# EAGLE design safssss (EAGLE 9.1.1)
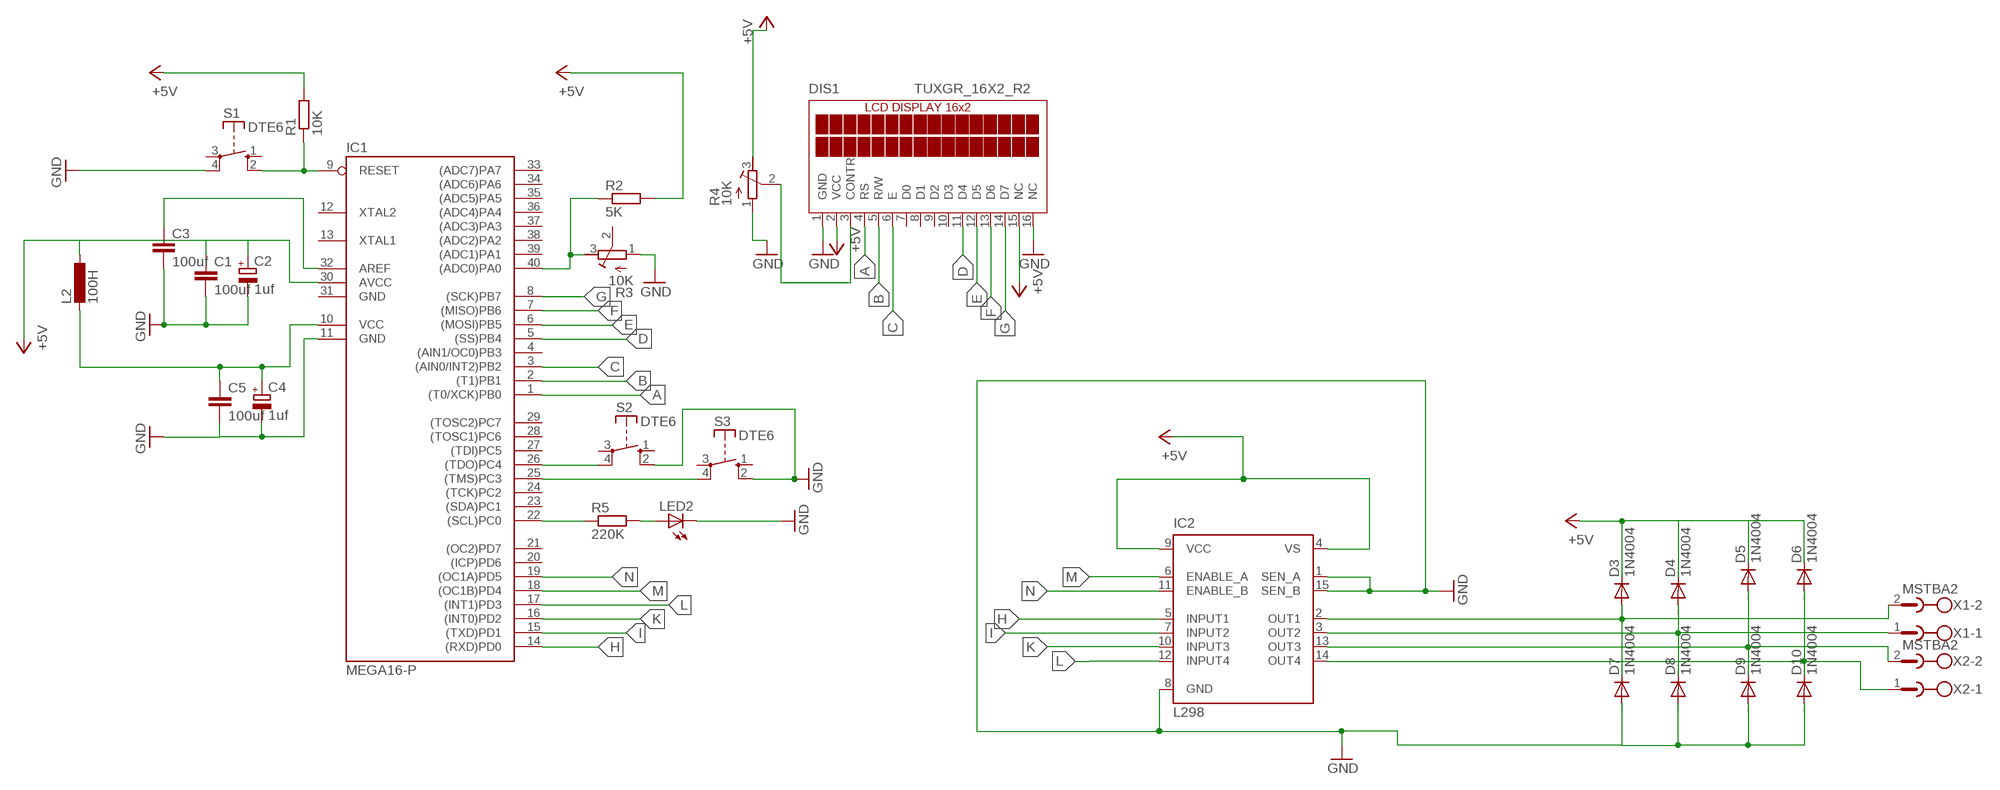
[diagram p0: schematic, sheet 1]

## Parts
C1  100uf  C-EU025-024X044  [C025-024X044]
C2  1uf  CPOL-EUB45181A  [B45181A]
C3  100uf  C-EU025-024X044  [C025-024X044]
C4  1uf  CPOL-EUB45181A  [B45181A]
C5  100uf  C-EU025-024X044  [C025-024X044]
D3  1N4004  [DO41-10]
D4  1N4004  [DO41-10]
D5  1N4004  [DO41-10]
D6  1N4004  [DO41-10]
D7  1N4004  [DO41-10]
D8  1N4004  [DO41-10]
D9  1N4004  [DO41-10]
D10  1N4004  [DO41-10]
DIS1  TUXGR_16X2_R2  [TUXGR_16X2_R2]
IC1  MEGA16-P  [DIL40]
IC2  L298  [MULTIWATT-15]
L2  100H  L-EU0204V  [0204V]
LED2  LED3MM  [LED3MM]
R1  10K  R-EU_0204/2V  [0204V]
R2  5K  R-EU_0204/2V  [0204V]
R3  10K  R-TRIMM64Z  [RTRIM64Z]
R4  10K  R-TRIMM64Z  [RTRIM64Z]
R5  220K  R-EU_0204/2V  [0204V]
S1  DTE6  [DTE6]
S2  DTE6  [DTE6]
S3  DTE6  [DTE6]
X1  MSTBA2  [MSTBA2]
X2  MSTBA2  [MSTBA2]

## Nets
+5V: C1.1 C2.+ D3.C D4.C D5.C D6.C DIS1.2(VCC) DIS1.15(NC) IC1.30(AVCC) IC2.4(VS) IC2.9(VCC) L2.1 R1.2 R2.2 R4.3(E)
A: DIS1.4(RS) IC1.1((T0/XCK)PB0)
B: DIS1.5(R/W) IC1.2((T1)PB1)
C: DIS1.6(E) IC1.3((AIN0/INT2)PB2)
D: DIS1.11(D4) IC1.5((SS)PB4)
E: DIS1.12(D5) IC1.6((MOSI)PB5)
F: DIS1.13(D6) IC1.7((MISO)PB6)
G: DIS1.14(D7) IC1.8((SCK)PB7)
GND: C1.2 C2.- C3.2 C4.- C5.2 D7.A D8.A D9.A D10.A DIS1.1(GND) DIS1.16(NC) IC1.11(GND) IC2.1(SEN_A) IC2.8(GND) IC2.15(SEN_B) LED2.K(C) R3.1(A) R4.1(A) S1.4(P) S2.2(S) S3.2(S)
H: IC1.14((RXD)PD0) IC2.5(INPUT1)
I: IC1.15((TXD)PD1) IC2.7(INPUT2)
K: IC1.16((INT0)PD2) IC2.10(INPUT3)
L: IC1.17((INT1)PD3) IC2.12(INPUT4)
M: IC1.18((OC1B)PD4) IC2.6(ENABLE_A)
N: IC1.19((OC1A)PD5) IC2.11(ENABLE_B)
N$1: IC1.9(RESET) R1.1 S1.2(S)
N$2: IC1.40((ADC0)PA0) R2.1 R3.3(E)
N$3: C3.1 IC1.32(AREF)
N$4: C4.+ C5.1 IC1.10(VCC) L2.2
N$5: DIS1.3(CONTR) R4.2(S)
N$6: IC1.22((SCL)PC0) R5.1
N$7: LED2.A R5.2
N$8: D3.A D7.C IC2.2(OUT1) X1.2
N$9: D4.A D8.C IC2.3(OUT2) X1.1
N$10: D5.A D9.C IC2.13(OUT3) X2.2
N$11: D6.A D10.C IC2.14(OUT4) X2.1
N$12: IC1.26((TDO)PC4) S2.4(P)
N$13: IC1.25((TMS)PC3) S3.4(P)
Unconnected: DIS1.7(D0) DIS1.8(D1) DIS1.9(D2) DIS1.10(D3) IC1.4((AIN1/OC0)PB3) IC1.12(XTAL2) IC1.13(XTAL1) IC1.20((ICP)PD6) IC1.21((OC2)PD7) IC1.23((SDA)PC1) IC1.24((TCK)PC2) IC1.27((TDI)PC5) IC1.28((TOSC1)PC6) IC1.29((TOSC2)PC7) IC1.33((ADC7)PA7) IC1.34((ADC6)PA6) IC1.35((ADC5)PA5) IC1.36((ADC4)PA4) IC1.37((ADC3)PA3) IC1.38((ADC2)PA2) IC1.39((ADC1)PA1) R3.2(S) S1.1(S) S1.3(P) S2.1(S) S2.3(P) S3.1(S) S3.3(P)

## Power pins joined to a net without a drawn wire
GND: IC1.31(GND)

## Library data of the parts
C1 C3 C5 = rcl:C-EU: CAPACITOR, European symbol; SPICEPREFIX: C
C2 C4 = rcl:CPOL-EU: POLARIZED CAPACITOR, European symbol; SPICEPREFIX: C
D3 D5-D10 = diode:1N4004: DIODE general purpose rectifier, 1 A; SPICEPREFIX: D
D4 = diode:1N4004: DIODE general purpose rectifier, 1 A
DIS1 = display-lcd:TUXGR_16X2_R2: Tuxgraphics LCD display 16x2 characters reflective, without background light Source: tuxgr_12x2_r2.pdf; OC_FARNELL: unknown; OC_NEWARK: unknown
IC1 = atmel:MEGA16-P: MICROCONTROLLER 16 Kbytes FLASH 1 kbytes SRAM 512 bytes EEPROM USART 8-channel 10 bit ADC Source: avr.lbr; MPN: ATMEGA16-16PU; OC_FARNELL: 9171142; OC_NEWARK: 01M6885
IC2 = st-microelectronics:L298: DUAL FULL-BRIDGE DRIVER; MPN: L298N; OC_FARNELL: 1589425; OC_NEWARK: 32M1527
L2 = rcl:L-EU: INDUCTOR, European symbol; SPICEPREFIX: L
LED2 = led:LED: LED OSRAM: - CHIPLED LG R971, LG N971, LY N971, LG Q971, LY Q971, LO R971, LY R971 LH N974, LH R974 LS Q976, LO Q976, LY Q976 LO Q996 - Hyper CHIPLED LW Q18S LB Q993, LB Q99A, LB R99A - SideLED LS A670, LO A670, LY A670, LG A670, LP A670 LB A673, LV A673, LT A673, LW A673 LH A674 LY A675 LS A676, LA A676, LO A676, LY A676, LW A676 LS A679, LY A679, LG A679 - Hyper Micro SIDELED® LS Y876, LA Y876, LO Y876, LY Y876 LT Y87S - SmartLED LW L88C, LW L88S LB L89C, LB L89S, LG L890 LS L89K, LO L89K, LY L89K LS L896, LA L896, LO L896, LY L896 - TOPLED LS T670, LO T670, LY T670, LG T670, LP T670 LSG T670, LSP T670, LSY T670, LOP T670, LYG T670 LG T671, LOG T671, LSG T671 LB T673, LV T673, LT T673, LW T673 LH T674 LS T676, LA T676, LO T676, LY T676, LB T676, LH T676, LSB T676, LW T676 LB T67C, LV T67C, LT T67C, LS T67K, LO T67K, LY T67K, LW E67C LS E67B, LA E67B, LO E67B, LY E67B, LB E67C, LV E67C, LT E67C LW T67C LS T679, LY T679, LG T679 LS T770, LO T770, LY T770, LG T770, LP T770 LB T773, LV T773, LT T773, LW T773 LH T774 LS E675, LA E675, LY E675, LS T675 LS T776, LA T776, LO T776, LY T776, LB T776 LHGB T686 LT T68C, LB T68C - Hyper Mini TOPLED® LB M676 - Mini TOPLED Santana® LG M470 LS M47K, LO M47K, LY M47K Source: http://www.osram.convergy.de LUXEON: - LUMILED® LXK2-PW12-R00, LXK2-PW12-S00, LXK2-PW14-U00, LXK2-PW14-V00 LXK2-PM12-R00, LXK2-PM12-S00, LXK2-PM14-U00 LXK2-PE12-Q00, LXK2-PE12-R00, LXK2-PE12-S00, LXK2-PE14-T00, LXK2-PE14-U00 LXK2-PB12-K00, LXK2-PB12-L00, LXK2-PB12-M00, LXK2-PB14-N00, LXK2-PB14-P00, LXK2-PB14-Q00 LXK2-PR12-L00, LXK2-PR12-M00, LXK2-PR14-Q00, LXK2-PR14-R00 LXK2-PD12-Q00, LXK2-PD12-R00, LXK2-PD12-S00 LXK2-PH12-R00, LXK2-PH12-S00 LXK2-PL12-P00, LXK2-PL12-Q00, LXK2-PL12-R00 Source: www.luxeon.com KINGBRIGHT: KA-3528ASYC Source: www.kingbright.com
R1 R2 R5 = resistor:R-EU_: RESISTOR, European symbol
R3 R4 = resistor:R-TRIMM: Trimm resistor
S1-S3 = switch-misc:DT: ITT SWITCH
X1 X2 = con-phoenix-508:MSTBA2: PHOENIX; MF: FARNELL; MPN: 1757242; OC_FARNELL: 3705171; OC_NEWARK: 71C4161

## Board
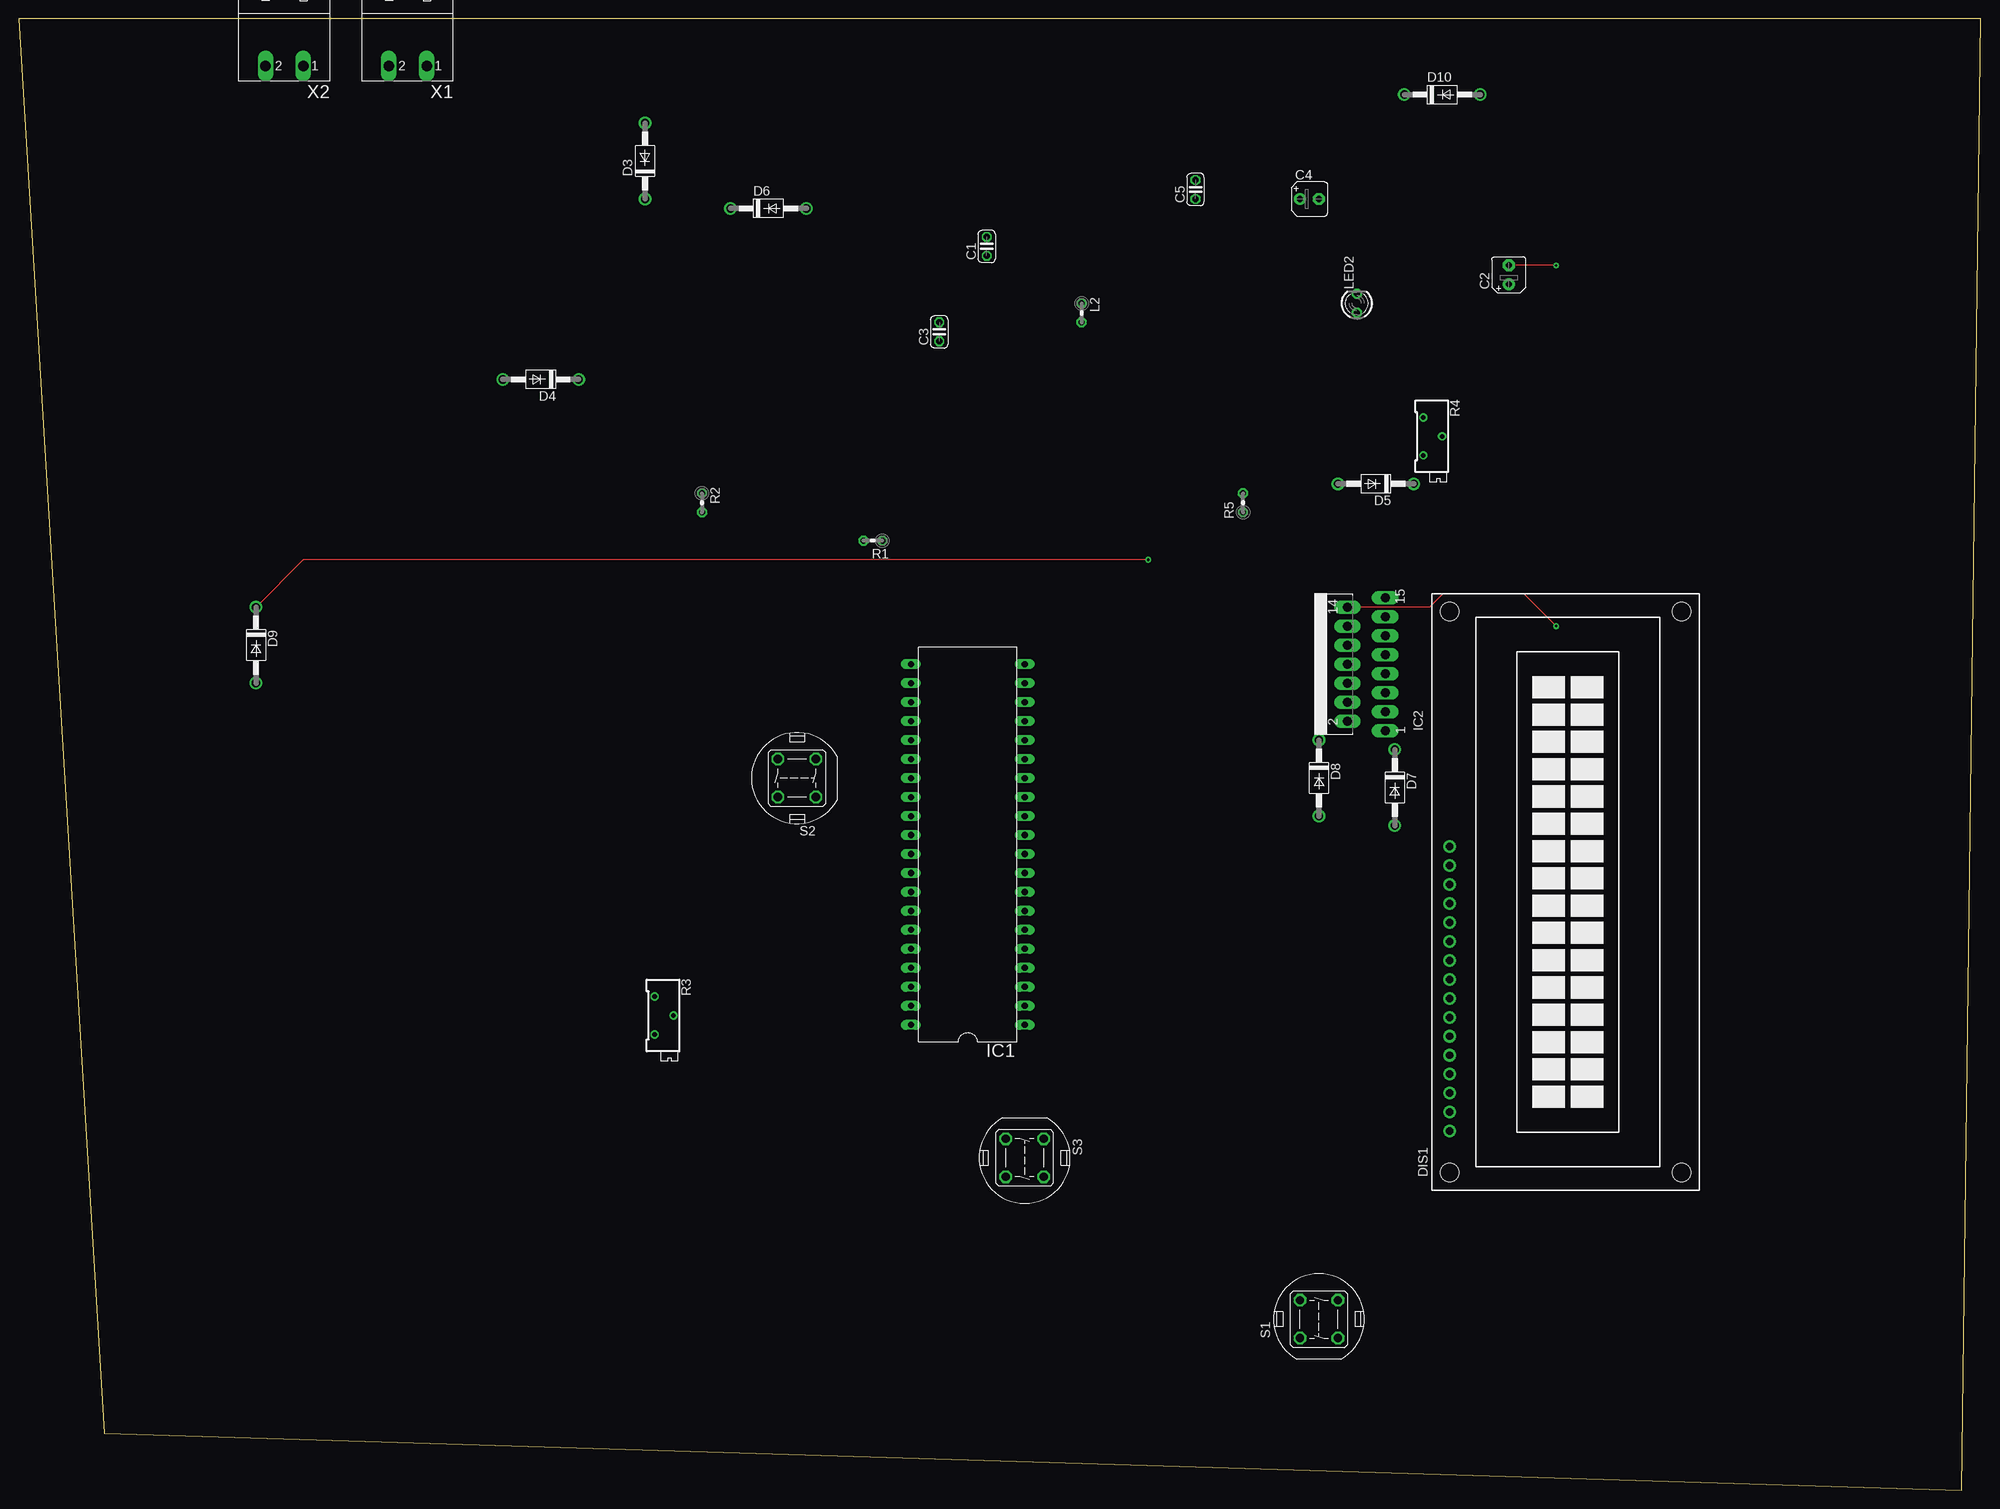
[diagram p1: board, top side]
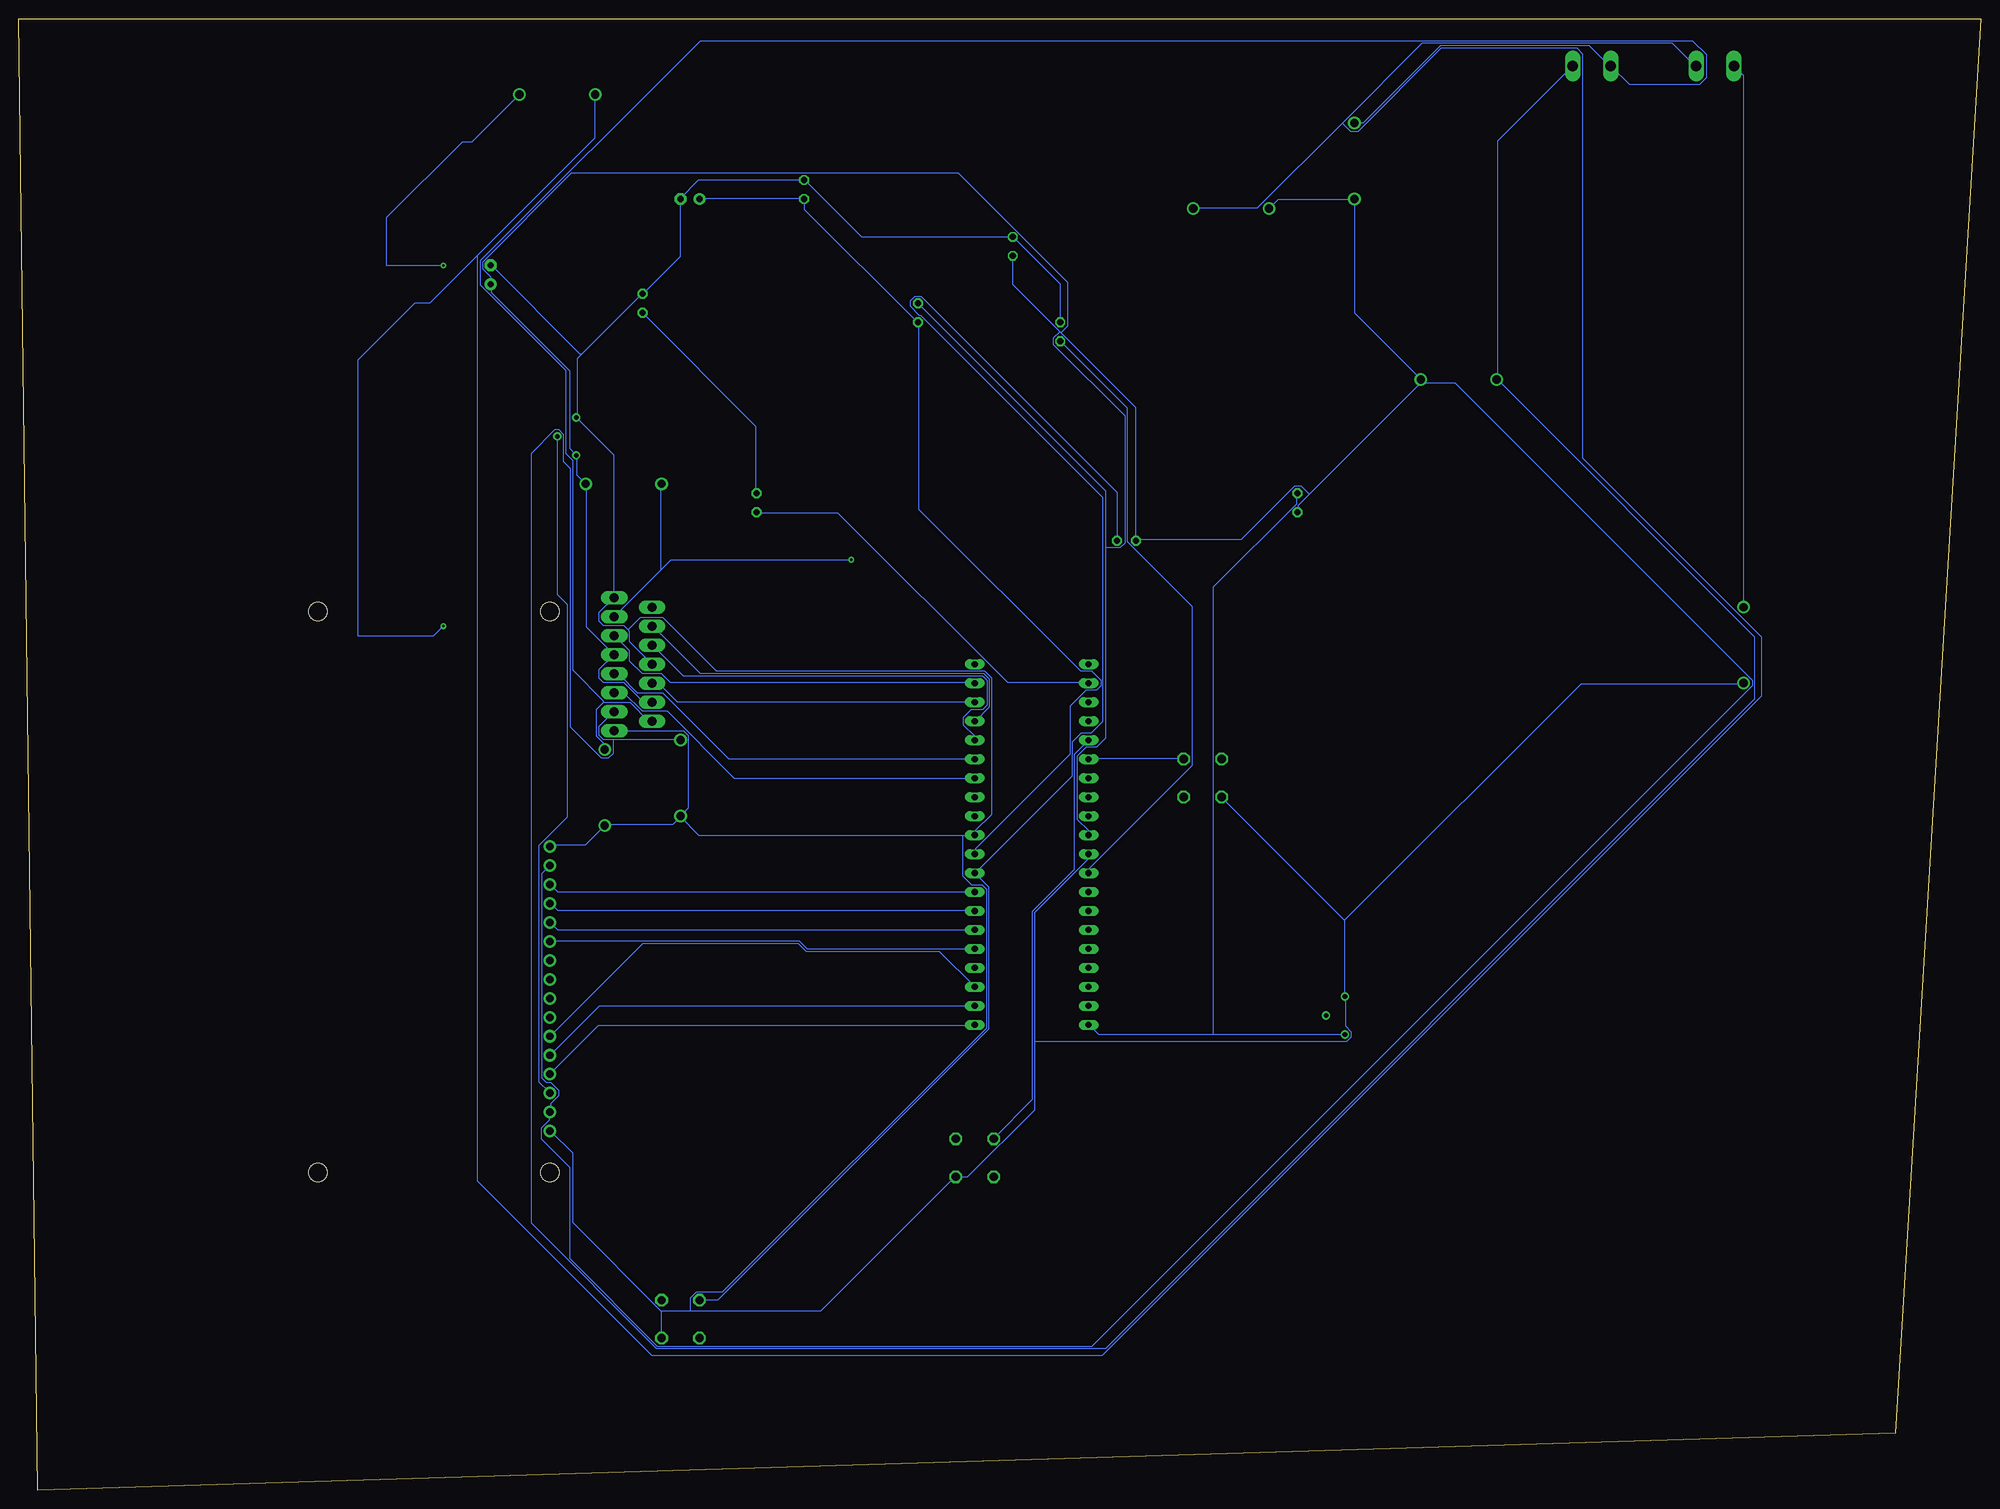
[diagram p2: board, bottom side, seen from below]

Size 262.56 x 196.84 mm. Coordinates in mm from the lower left corner, seen from the top.
Outline: 11.43,7.62 260.02,0 262.56,196.84 0,196.84 11.43,7.62
Copper layers (1*16): Top 0.035mm / dielectric 1.5mm / Bottom 0.035mm
Design rules "default": minimum track width 6mil, minimum drill 0.35mm, track to track 6mil, track to pad 6mil, pad to pad 6mil, via to via 6mil, smd to smd 6mil, copper to edge 40mil, drill to drill 6mil, minimum pad ring 10mil, minimum via ring 8mil, stop-mask expansion 4mil, vias tented up to drill 0mil, thermal gap 10mil

### Footprints (pad centres in the part's own frame; a part is rotated, then mirrored left to right if it is on the bottom)
C025-024X044 = drill 0.813 octagon: 1 -1.27,0; 2 1.27,0
B45181A = drill 0.813 pad 1.6: + -1.27,0 | drill 0.813 pad 1.6 octagon: - 1.27,0
DO41-10 = drill 1.118: A 5.08,0; C -5.08,0
TUXGR_16X2_R2 = drill 1 pad 1.676: 1 -32,15.5; 2 -29.46,15.5; 3 -26.92,15.5; 4 -24.38,15.5; 5 -21.84,15.5; 6 -19.3,15.5; 7 -16.76,15.5; 8 -14.22,15.5; 9 -11.68,15.5; 10 -9.14,15.5; 11 -6.6,15.5; 12 -4.06,15.5; 13 -1.52,15.5; 14 1.02,15.5; 15 3.56,15.5; 16 6.1,15.5 | hole 2.5: -37.5,-15.5; 37.5,-15.5; -37.5,15.5; 37.5,15.5
DIL40 = drill 0.813 long: 1 -24.13,-7.62; 2 -21.59,-7.62; 3 -19.05,-7.62; 4 -16.51,-7.62; 5 -13.97,-7.62; 6 -11.43,-7.62; 7 -8.89,-7.62; 8 -6.35,-7.62; 9 -3.81,-7.62; 10 -1.27,-7.62; 11 1.27,-7.62; 12 3.81,-7.62; 13 6.35,-7.62; 14 8.89,-7.62; 15 11.43,-7.62; 16 13.97,-7.62; 17 16.51,-7.62; 18 19.05,-7.62; 19 21.59,-7.62; 20 24.13,-7.62; 21 24.13,7.62; 22 21.59,7.62; 23 19.05,7.62; 24 16.51,7.62; 25 13.97,7.62; 26 11.43,7.62; 27 8.89,7.62; 28 6.35,7.62; 29 3.81,7.62; 30 1.27,7.62; 31 -1.27,7.62; 32 -3.81,7.62; 33 -6.35,7.62; 34 -8.89,7.62; 35 -11.43,7.62; 36 -13.97,7.62; 37 -16.51,7.62; 38 -19.05,7.62; 39 -21.59,7.62; 40 -24.13,7.62
MULTIWATT-15 = drill 1.2 long: 1 -8.89,-7.62; 2 -7.62,-2.54; 3 -6.35,-7.62; 4 -5.08,-2.54; 5 -3.81,-7.62; 6 -2.54,-2.54; 7 -1.27,-7.62; 8 0,-2.54; 9 1.27,-7.62; 10 2.54,-2.54; 11 3.81,-7.62; 12 5.08,-2.54; 13 6.35,-7.62; 14 7.62,-2.54; 15 8.89,-7.62
0204V = drill 0.813 octagon: 1 -1.27,0; 2 1.27,0
LED3MM = drill 0.813 octagon: A -1.27,0; K 1.27,0
RTRIM64Z = drill 0.61: 1 0,-2.54; 2 -2.54,0; 3 0,2.54
DTE6 = drill 1.118 octagon: 1 -2.54,2.54; 2 2.54,2.54; 3 2.54,-2.54; 4 -2.54,-2.54
MSTBA2 = drill 1.397 long: 1 -2.54,5.08; 2 2.54,5.08

### Placement (x,y rotation side)
C1  129.54,166.37 90 top
C2  199.39,162.56 90 top
C3  123.19,154.94 90 top
C4  172.72,172.72 0 top
C5  157.48,173.99 90 top
D3  83.82,177.8 90 top
D4  69.85,148.59 180 top
D5  181.61,134.62 180 top
D6  100.33,171.45 0 top
D7  184.15,93.98 270 top
D8  173.99,95.25 270 top
D9  31.75,113.03 270 top
D10  190.5,186.69 0 top
DIS1  207.01,80.01 90 top
IC1  127,86.36 90 top
IC2  175.26,110.49 90 top
L2  142.24,157.48 270 top
LED2  179.07,158.75 90 top
R1  114.3,127 180 top
R2  91.44,132.08 270 top
R3  85.09,63.5 180 top
R4  187.96,140.97 180 top
R5  163.83,132.08 90 top
S1  173.99,22.86 90 top
S2  104.14,95.25 180 top
S3  134.62,44.45 270 top
X1  52.07,195.58 180 top
X2  35.56,195.58 180 top

### Tracks (layer width: path | path; a pad name or v marks a point on that pad's centre or on a via)
+5V
  Bottom 0.152: 117.15,126.03 117.15,133.66 L2.1 | 117.15,126.03 117.15,100.58 118.36,99.37 119.74,99.37 120.96,98.15 120.96,89.76 119.43,88.24 119.43,87.63 IC1.30 | IC2.4 177.8,105.46 179.02,105.46 181.61,108.05 184.35,108.05 184.96,108.66 184.96,109.73 182.98,111.71 IC2.9 186.64,115.52 186.64,134.57 D5.C 187.86,135.79 187.86,138.38 R4.3 188.01,138.53 188.77,139.29 188.77,149.66 199.29,160.17 199.29,161.24 C2.+ 199.44,161.39 199.44,162.31 200.51,163.37 200.51,164.29 188.62,176.17 136.8,176.17 122.17,161.54 122.17,155.75 123.09,154.84 | DIS1.15 191.52,83.52 192.58,82.45 192.58,55.17 191.97,54.56 191.36,54.56 190.3,53.49 190.3,52.73 191.36,51.66 191.36,50.6 DIS1.2 191.52,50.44 191.52,49.53 192.58,48.46 192.58,46.94 188.77,43.13 188.77,30.94 177.04,19.2 118.97,19.2 30.58,107.59 30.58,108.36 70.36,148.13 74.93,148.13 | D6.C 95.2,171.45 93.98,172.67 83.92,172.67 D3.C 83.77,172.67 83.77,157.43 D4.C 74.93,148.13 | 74.93,148.13 89.87,133.2 | 89.87,133.2 91.39,131.67 91.39,130.91 R2.2 | 113.03,127.1 99.01,127.1 91.85,134.26 90.93,134.26 89.87,133.2 | 123.09,154.84 113.03,144.78 113.03,127.1 | 123.09,154.84 123.24,154.99 | 123.24,154.99 129.49,161.24 129.49,165.05 C1.1 | 113.03,127.1 R1.2 | 117.15,126.03 115.16,126.03 114.55,126.64 114.55,143.71 124.16,153.31 124.16,154.08 123.24,154.99
A
  Bottom 0.152: IC1.1 134.67,62.18 184.96,62.18 191.36,55.78 DIS1.4
B
  Bottom 0.152: IC1.2 184.81,64.77 191.36,58.22 DIS1.5
C
  Bottom 0.152: IC1.3 139.4,72.09 157.23,72.09 158.29,73.15 179.02,73.15 191.36,60.81 DIS1.6
D
  Bottom 0.152: IC1.5 157.07,72.39 158.14,73.46 191.36,73.46 DIS1.11
E
  Bottom 0.152: IC1.6 134.67,74.98 190.45,74.98 191.36,75.9 DIS1.12
F
  Bottom 0.152: IC1.7 134.67,77.57 190.45,77.57 191.36,78.49 DIS1.13
G
  Bottom 0.152: IC1.8 190.45,80.01 191.36,80.92 DIS1.14
GND  (via drill 0.35)
  Top 0.152: v205.74,163.83 C2.-
  Bottom 0.152: DIS1.16 191.36,86.26 186.79,86.26 D7.A 184.05,89 175.06,89 173.99,90.07 | 136.19,87.63 171.55,87.63 173.99,90.07 | 136.19,87.63 IC1.11 134.52,87.63 134.52,88.24 132.38,90.37 132.38,108.66 133.3,109.58 169.27,109.58 176.43,116.74 179.32,116.74 181,115.06 | IC2.1 182.83,101.5 173.53,101.5 172.92,100.89 172.92,91.29 173.99,90.22 D8.A 173.99,90.07 | C3.2 123.24,156.21 123.24,161.39 129.49,167.64 C1.2 149.76,167.64 157.38,175.26 C5.2 171.55,175.26 173.99,172.82 C4.- 173.99,165.05 179.02,160.02 LED2.K 179.17,160.02 187.25,151.94 | IC2.8 180.85,113.54 180.85,114.91 181,115.06 | 181,115.06 181.61,115.67 184.35,115.67 184.96,116.28 184.96,117.35 182.98,119.33 IC2.15 182.98,119.48 182.98,138.53 R4.1 187.86,143.56 187.86,151.33 187.25,151.94 | 187.25,151.94 187.4,151.94 199.29,163.83 C2.- | 85.14,76.2 85.14,66.14 R3.1 84.99,65.99 84.99,62.03 84.23,61.27 84.23,60.66 84.84,60.05 126.59,60.05 | 85.14,76.2 101.6,92.66 S2.2 | 85.14,76.2 53.44,107.9 31.8,107.9 D9.A | 176.58,23.93 176.58,20.42 S1.4 | 176.58,23.93 188.47,35.81 188.47,45.11 191.36,48.01 DIS1.1 | 126.59,60.05 126.59,50.9 135.59,41.91 S3.2 137.26,41.91 155.25,23.93 172.62,23.93 | 126.59,60.05 126.59,77.27 119.43,84.43 119.43,85.04 IC1.31 | 172.62,23.93 176.58,23.93 | 136.19,87.63 136.19,82.14 134.98,80.92 133.6,80.92 132.99,80.31 132.99,61.87 168.35,26.52 171.86,26.52 172.62,25.76 172.62,23.93 | D10.A 201.93,180.34 203.2,180.34 213.36,170.18 213.36,163.83 v205.74,163.83
H
  Bottom 0.152: IC1.14 166.83,95.25 175.82,104.24 179.17,104.24 181.61,106.68 IC2.5
I
  Bottom 0.152: IC1.15 134.67,97.84 167.59,97.84 176.43,106.68 179.78,106.68 182.22,109.12 182.83,109.12 IC2.7
K
  Bottom 0.152: IC1.16 134.67,100.43 134.67,100.89 136.19,102.41 136.19,103.33 135.13,104.39 133.6,104.39 132.99,105 132.99,108.36 133.6,108.97 173.69,108.97 177.8,113.08 IC2.10
L
  Bottom 0.152: IC1.17 134.52,102.87 132.69,104.7 132.69,108.51 133.45,109.27 171.4,109.27 177.8,115.67 IC2.12
M
  Bottom 0.152: IC1.18 134.67,105.46 174.45,105.46 176.89,107.9 177.8,107.9 IC2.6
N
  Bottom 0.152: IC1.19 134.67,108.05 175.36,108.05 176.58,109.27 179.17,109.27 180.85,110.95 180.85,112.32 182.83,114.3 IC2.11
N$1
  Bottom 0.152: S1.2 171.4,25.45 168.96,25.45 132.69,61.72 132.69,80.62 IC1.9 134.52,82.6 121.56,95.56 121.56,100.13 120.34,101.35 118.97,101.35 117.45,102.87 117.45,132.74 141.83,157.12 141.99,157.12 143.21,158.34 143.21,159.11 142.6,159.72 141.83,159.72 115.62,133.5 115.62,127.1 R1.1
N$2
  Bottom 0.152: 102.67,60.96 118.06,60.96 119.28,62.18 IC1.40 | 102.67,60.96 R3.3 | 102.67,60.96 102.67,120.85 91.54,131.98 91.54,133.35 R2.1
N$3
  Bottom 0.152: IC1.32 119.28,82.6 119.28,83.21 105.56,96.93 105.56,118.26 114.25,126.95 114.25,144.78 123.09,153.62 C3.1
N$4
  Bottom 0.152: C4.+ 171.4,172.82 157.53,172.82 C5.1 157.38,172.67 157.38,171.3 142.29,156.21 L2.2 142.14,156.21 142.14,131.22 120.5,109.58 118.97,109.58 117.75,108.36 117.75,107.59 118.36,106.99 119.74,106.99 121.87,104.85 121.87,98.45 134.52,85.8 134.52,85.19 IC1.10
N$5
  Bottom 0.152: R4.2 190.45,140.97 190.45,119.79 189.08,118.42 189.08,90.07 192.89,86.26 192.89,54.56 191.52,53.19 DIS1.3
N$6
  Bottom 0.152: IC1.22 119.43,108.05 130.25,108.05 152.96,130.76 163.78,130.76 R5.1
N$7
  Bottom 0.152: LED2.A 163.93,142.34 163.93,133.35 R5.2
N$8
  Bottom 0.152: 184.35,105.31 185.27,104.39 185.27,100.89 184.2,99.82 184.2,99.06 D7.C | 184.35,105.31 180.7,105.31 178.26,102.87 IC2.2 | D3.A 82.7,182.88 72.34,193.24 52.38,193.24 49.63,190.5 X1.2 49.48,190.5 47.04,188.06 37.59,188.06 36.68,188.98 36.68,192.02 38.51,193.85 171.4,193.85 200.81,164.44 200.81,161.24 189.38,149.81 189.38,138.68 188.47,137.77 188.47,109.73 184.35,105.61 184.35,105.31
N$9
  Bottom 0.152: 182.98,100.43 184.35,100.43 184.96,101.04 184.96,102.11 182.98,104.09 IC2.3 | 182.98,100.43 173.99,100.43 D8.C | 64.72,148.59 64.72,180.44 54.66,190.5 X1.1 | 182.98,100.43 182.98,98.6 183.59,97.99 184.66,97.99 188.77,102.11 188.77,136.7 189.69,137.62 189.69,141.28 190.3,141.88 190.75,141.88 193.95,138.68 193.95,35.66 177.19,18.9 117.15,18.9 30.28,105.77 30.28,114.15 64.72,148.59 | 64.72,148.59 D4.A
N$10  (via drill 0.35)
  Top 0.152: v151.13,124.46 38.1,124.46 D9.C
  Bottom 0.152: X2.2 31.8,189.28 31.8,118.11 D9.C | 176.58,123.14 176.58,134.57 D5.A | IC2.13 176.58,123.14 | 176.58,123.14 175.26,124.46 v151.13,124.46
N$11  (via drill 0.35)
  Top 0.152: IC2.14 188.8,118.11 190.54,119.85 201.46,119.85 v205.74,115.57
  Bottom 0.152: D6.A 96.88,171.45 85.45,182.88 | 85.45,182.88 74.78,193.55 41.25,193.55 38.2,190.5 X2.1 | D10.C 185.42,180.9 201.12,165.2 | 201.12,165.2 201.12,41.3 177.8,17.98 117.6,17.98 29.36,106.22 29.36,114.15 53.29,138.07 53.29,192.18 54.05,192.94 72.19,192.94 83.31,181.81 84.38,181.81 85.45,182.88 | 201.12,165.2 207.57,158.75 209.55,158.75 217.17,151.13 217.17,114.3 207.01,114.3 v205.74,115.57
N$12
  Bottom 0.152: IC1.26 119.28,97.84 106.78,97.84 S2.4
N$13
  Bottom 0.152: IC1.25 121.26,98.45 121.26,83.06 126.9,77.42 126.9,52.27 132.08,47.09 S3.4